# EAGLE design sensorboard_eurobotics2010_r1 (EAGLE 4.16)

## Sheet 1 of 2
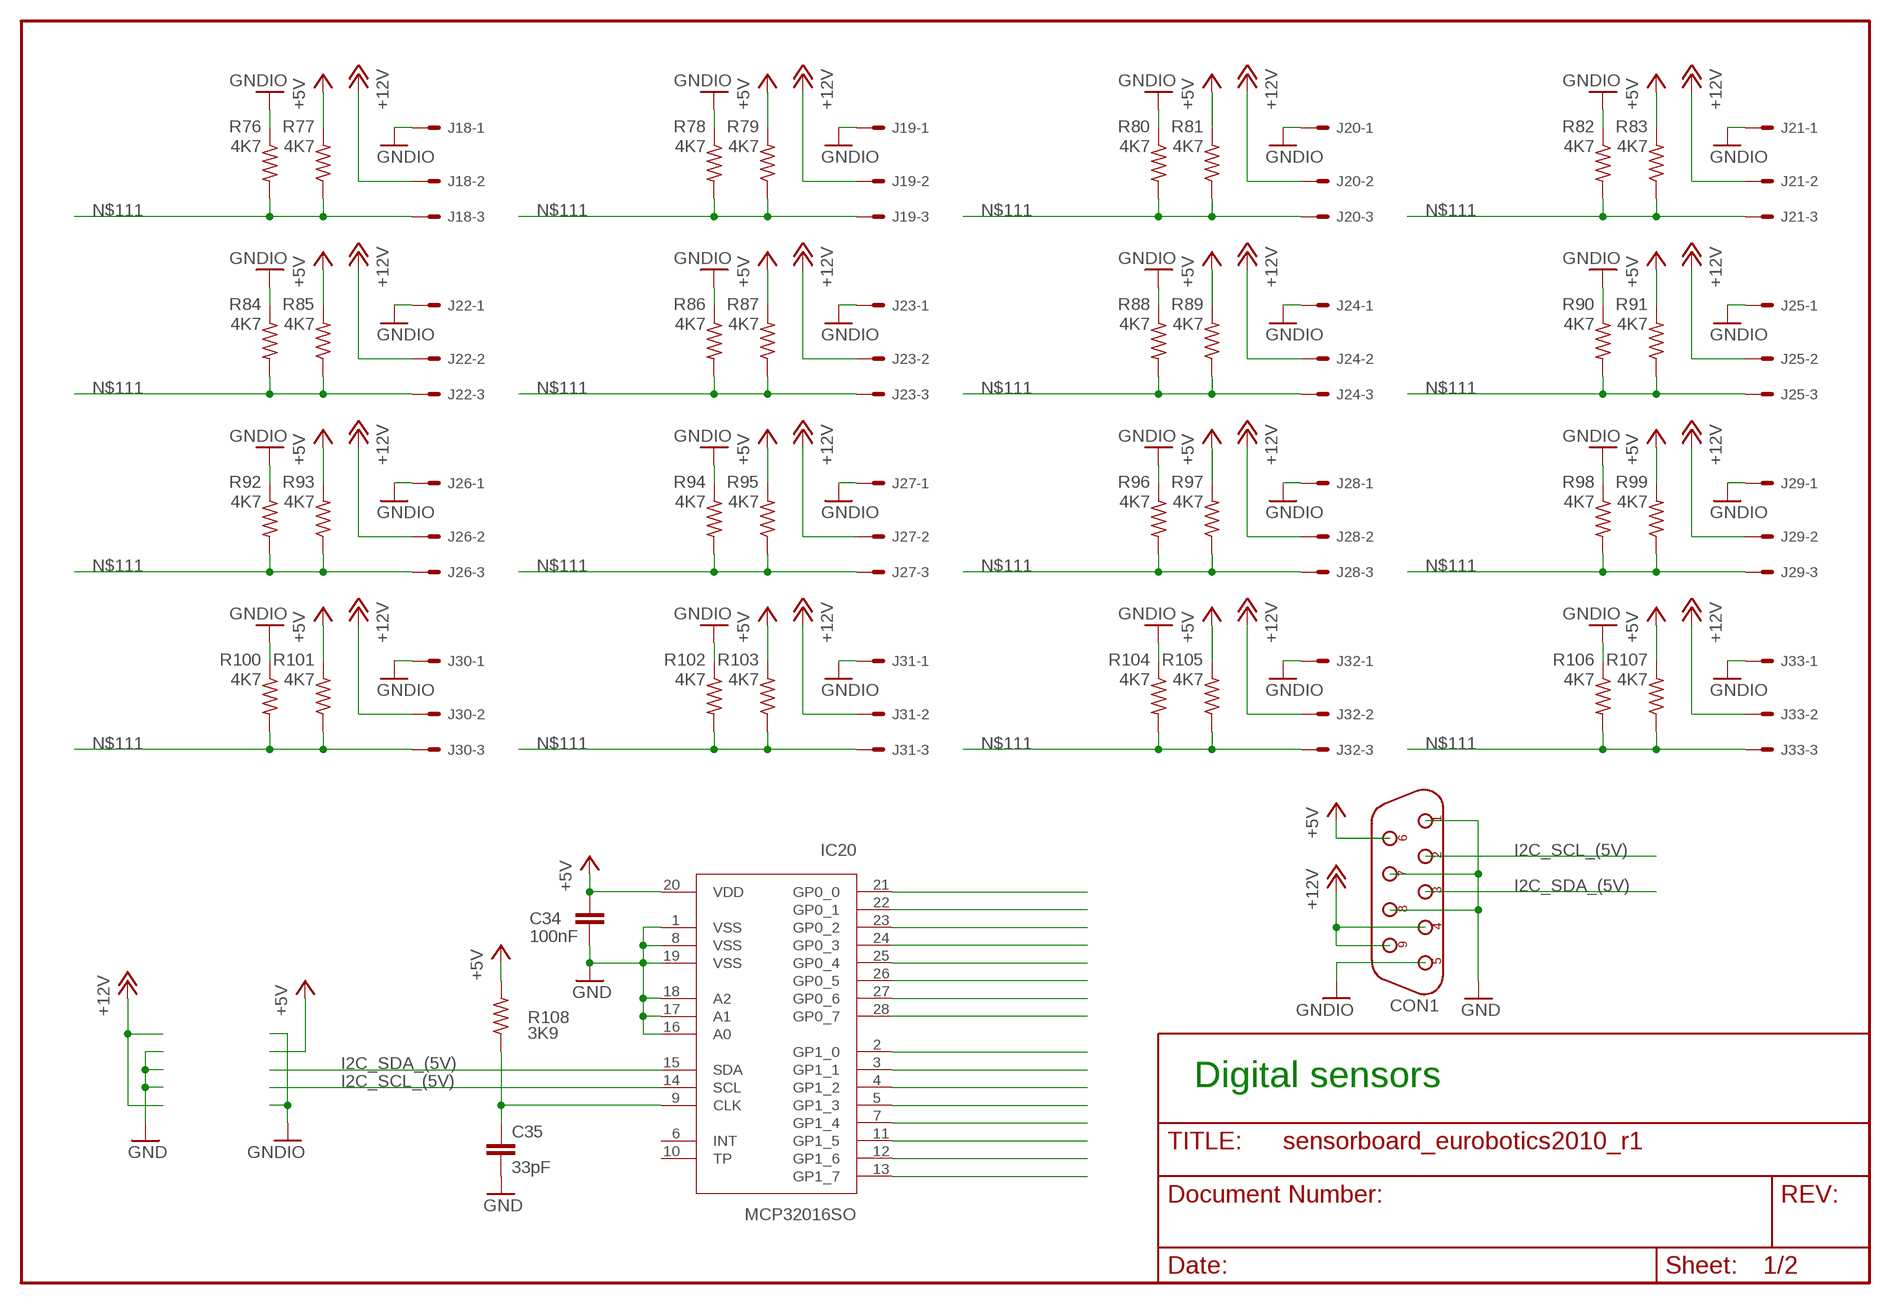
[diagram p0: schematic, sheet 1]

### Parts
C34  100nF  C-EUC0805  [C0805]
C35  33pF  C-EUC0805  [C0805]
CON1  DB9M  [D-09M]
IC20  MCP32016SO  [SO-28W]
J18  22-05-7038-03  [7395-03]
J19  22-05-7038-03  [7395-03]
J20  22-05-7038-03  [7395-03]
J21  22-05-7038-03  [7395-03]
J22  22-05-7038-03  [7395-03]
J23  22-05-7038-03  [7395-03]
J24  22-05-7038-03  [7395-03]
J25  22-05-7038-03  [7395-03]
J26  22-05-7038-03  [7395-03]
J27  22-05-7038-03  [7395-03]
J28  22-05-7038-03  [7395-03]
J29  22-05-7038-03  [7395-03]
J30  22-05-7038-03  [7395-03]
J31  22-05-7038-03  [7395-03]
J32  22-05-7038-03  [7395-03]
J33  22-05-7038-03  [7395-03]
R76  4K7  R-US_R0805  [R0805]
R77  4K7  R-US_R0805  [R0805]
R78  4K7  R-US_R0805  [R0805]
R79  4K7  R-US_R0805  [R0805]
R80  4K7  R-US_R0805  [R0805]
R81  4K7  R-US_R0805  [R0805]
R82  4K7  R-US_R0805  [R0805]
R83  4K7  R-US_R0805  [R0805]
R84  4K7  R-US_R0805  [R0805]
R85  4K7  R-US_R0805  [R0805]
R86  4K7  R-US_R0805  [R0805]
R87  4K7  R-US_R0805  [R0805]
R88  4K7  R-US_R0805  [R0805]
R89  4K7  R-US_R0805  [R0805]
R90  4K7  R-US_R0805  [R0805]
R91  4K7  R-US_R0805  [R0805]
R92  4K7  R-US_R0805  [R0805]
R93  4K7  R-US_R0805  [R0805]
R94  4K7  R-US_R0805  [R0805]
R95  4K7  R-US_R0805  [R0805]
R96  4K7  R-US_R0805  [R0805]
R97  4K7  R-US_R0805  [R0805]
R98  4K7  R-US_R0805  [R0805]
R99  4K7  R-US_R0805  [R0805]
R100  4K7  R-US_R0805  [R0805]
R101  4K7  R-US_R0805  [R0805]
R102  4K7  R-US_R0805  [R0805]
R103  4K7  R-US_R0805  [R0805]
R104  4K7  R-US_R0805  [R0805]
R105  4K7  R-US_R0805  [R0805]
R106  4K7  R-US_R0805  [R0805]
R107  4K7  R-US_R0805  [R0805]
R108  3K9  R-US_R0805  [R0805]

### Nets
+5V: C34.1 CON1.6 IC20.20(VDD) R77.2 R79.2 R81.2 R83.2 R85.2 R87.2 R89.2 R91.2 R93.2 R95.2 R97.2 R99.2 R101.2 R103.2 R105.2 R107.2 R108.2 ; also sheet 2
+12V: CON1.4 CON1.9 J18.2 J19.2 J20.2 J21.2 J22.2 J23.2 J24.2 J25.2 J26.2 J27.2 J28.2 J29.2 J30.2 J31.2 J32.2 J33.2 ; also sheet 2
GND: C34.2 C35.2 CON1.1 CON1.7 CON1.8 IC20.1(VSS) IC20.8(VSS) IC20.16(A0) IC20.17(A1) IC20.18(A2) IC20.19(VSS) ; also sheet 2
GNDIO: CON1.5 J18.1 J19.1 J20.1 J21.1 J22.1 J23.1 J24.1 J25.1 J26.1 J27.1 J28.1 J29.1 J30.1 J31.1 J32.1 J33.1 R76.1 R78.1 R80.1 R82.1 R84.1 R86.1 R88.1 R90.1 R92.1 R94.1 R96.1 R98.1 R100.1 R102.1 R104.1 R106.1 ; also sheet 2
I2C_SCL_(5V): CON1.2 IC20.14(SCL) ; also sheet 2
I2C_SDA_(5V): CON1.3 IC20.15(SDA) ; also sheet 2
N$63: C35.1 IC20.9(CLK) R108.1
N$68: IC20.21(GP0_0)
N$69: IC20.22(GP0_1)
N$97: IC20.23(GP0_2)
N$98: IC20.24(GP0_3)
N$99: IC20.25(GP0_4)
N$100: IC20.26(GP0_5)
N$101: IC20.27(GP0_6)
N$102: IC20.28(GP0_7)
N$103: IC20.2(GP1_0)
N$104: IC20.3(GP1_1)
N$105: IC20.4(GP1_2)
N$106: IC20.5(GP1_3)
N$107: IC20.7(GP1_4)
N$108: IC20.11(GP1_5)
N$109: IC20.12(GP1_6)
N$110: IC20.13(GP1_7)
N$111: J18.3 J19.3 J20.3 J21.3 J22.3 J23.3 J24.3 J25.3 J26.3 J27.3 J28.3 J29.3 J30.3 J31.3 J32.3 J33.3 R76.2 R77.1 R78.2 R79.1 R80.2 R81.1 R82.2 R83.1 R84.2 R85.1 R86.2 R87.1 R88.2 R89.1 R90.2 R91.1 R92.2 R93.1 R94.2 R95.1 R96.2 R97.1 R98.2 R99.1 R100.2 R101.1 R102.2 R103.1 R104.2 R105.1 R106.2 R107.1 ; also sheet 2
Unconnected: IC20.6(INT) IC20.10(TP)

### Notes on the sheet
- Digital sensors

## Sheet 2 of 2
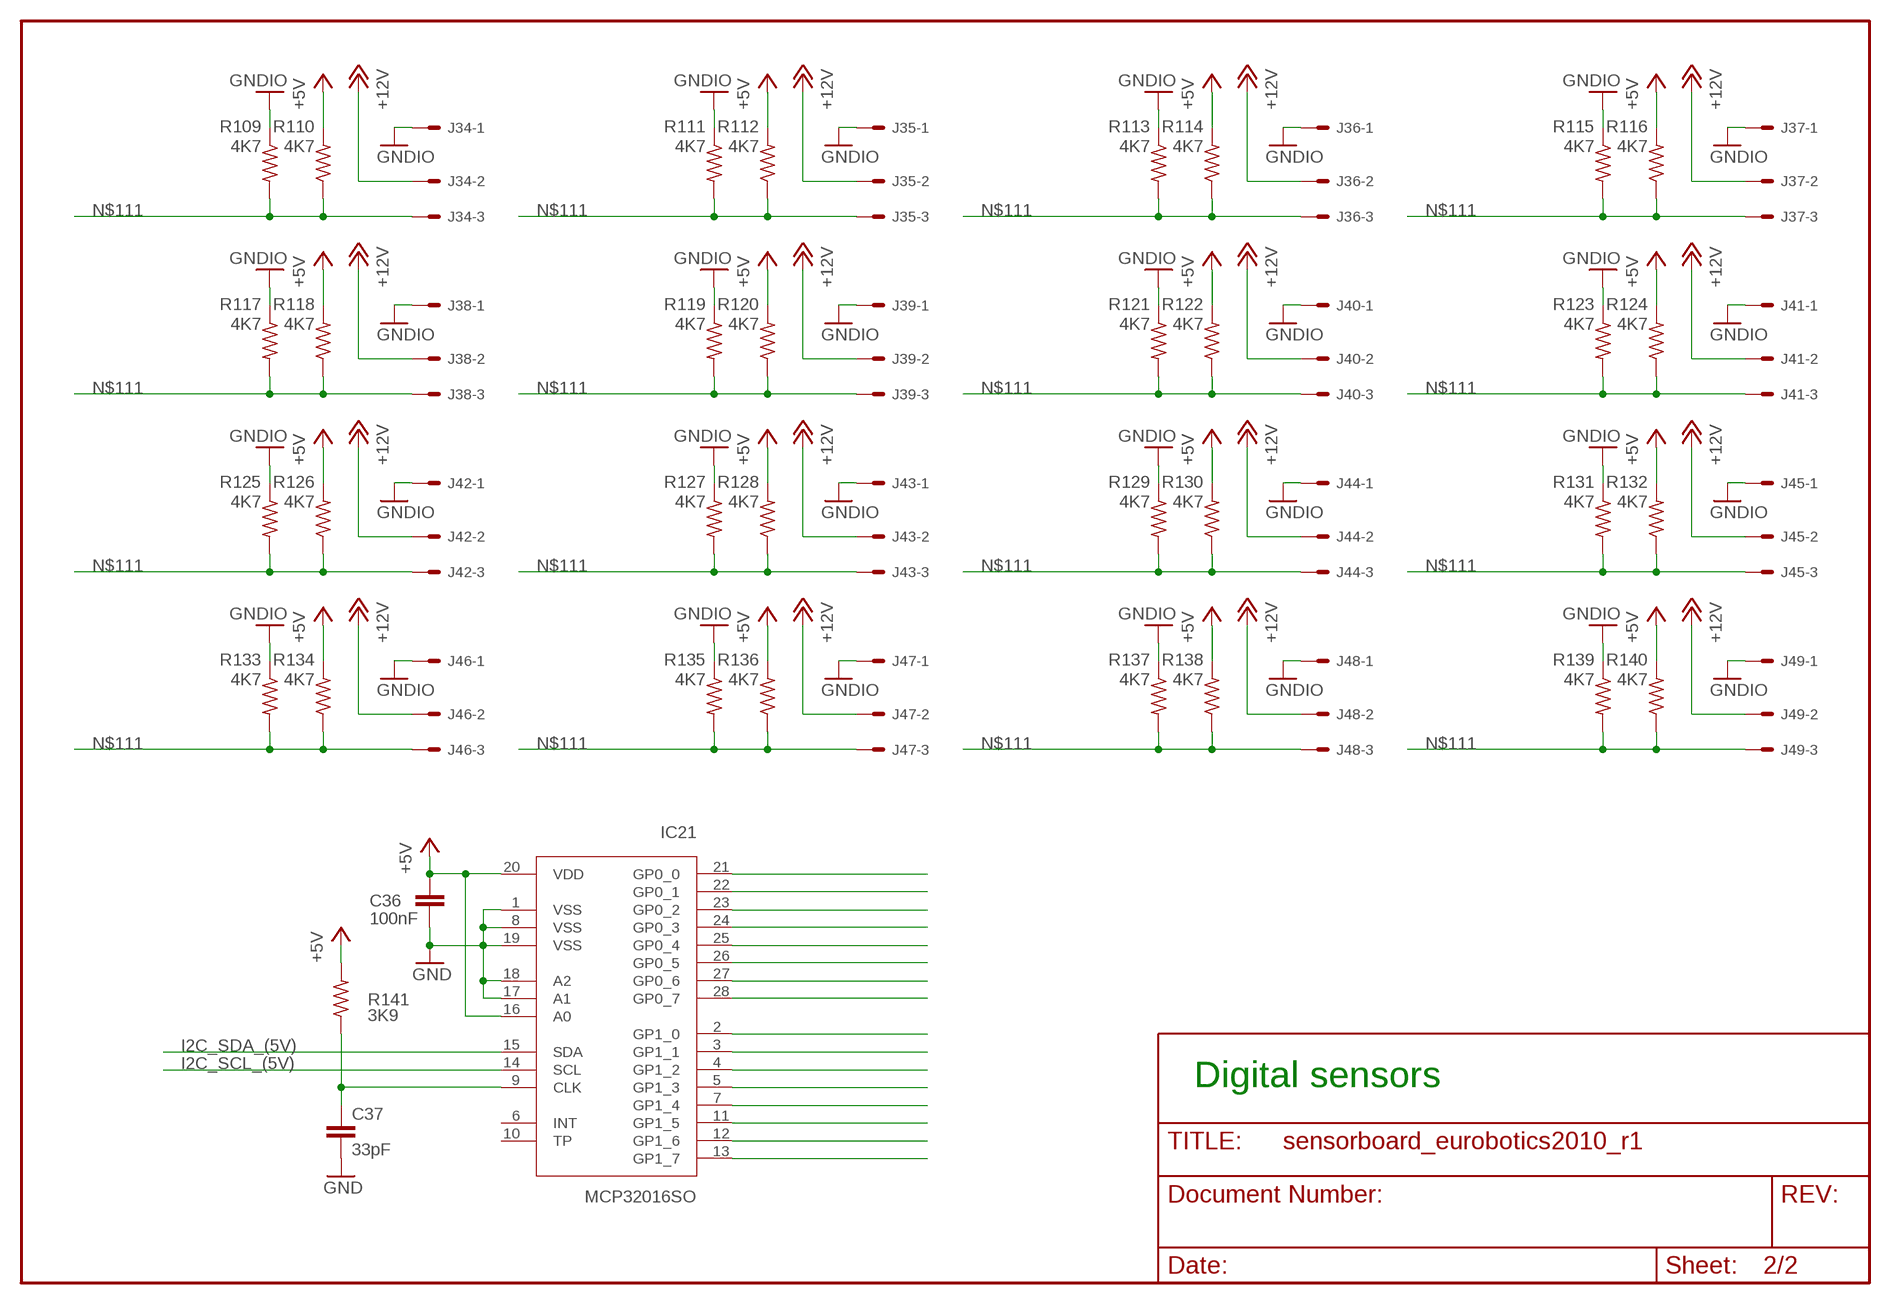
[diagram p1: schematic, sheet 2]

### Parts
C36  100nF  C-EUC0805  [C0805]
C37  33pF  C-EUC0805  [C0805]
IC21  MCP32016SO  [SO-28W]
J34  22-05-7038-03  [7395-03]
J35  22-05-7038-03  [7395-03]
J36  22-05-7038-03  [7395-03]
J37  22-05-7038-03  [7395-03]
J38  22-05-7038-03  [7395-03]
J39  22-05-7038-03  [7395-03]
J40  22-05-7038-03  [7395-03]
J41  22-05-7038-03  [7395-03]
J42  22-05-7038-03  [7395-03]
J43  22-05-7038-03  [7395-03]
J44  22-05-7038-03  [7395-03]
J45  22-05-7038-03  [7395-03]
J46  22-05-7038-03  [7395-03]
J47  22-05-7038-03  [7395-03]
J48  22-05-7038-03  [7395-03]
J49  22-05-7038-03  [7395-03]
R109  4K7  R-US_R0805  [R0805]
R110  4K7  R-US_R0805  [R0805]
R111  4K7  R-US_R0805  [R0805]
R112  4K7  R-US_R0805  [R0805]
R113  4K7  R-US_R0805  [R0805]
R114  4K7  R-US_R0805  [R0805]
R115  4K7  R-US_R0805  [R0805]
R116  4K7  R-US_R0805  [R0805]
R117  4K7  R-US_R0805  [R0805]
R118  4K7  R-US_R0805  [R0805]
R119  4K7  R-US_R0805  [R0805]
R120  4K7  R-US_R0805  [R0805]
R121  4K7  R-US_R0805  [R0805]
R122  4K7  R-US_R0805  [R0805]
R123  4K7  R-US_R0805  [R0805]
R124  4K7  R-US_R0805  [R0805]
R125  4K7  R-US_R0805  [R0805]
R126  4K7  R-US_R0805  [R0805]
R127  4K7  R-US_R0805  [R0805]
R128  4K7  R-US_R0805  [R0805]
R129  4K7  R-US_R0805  [R0805]
R130  4K7  R-US_R0805  [R0805]
R131  4K7  R-US_R0805  [R0805]
R132  4K7  R-US_R0805  [R0805]
R133  4K7  R-US_R0805  [R0805]
R134  4K7  R-US_R0805  [R0805]
R135  4K7  R-US_R0805  [R0805]
R136  4K7  R-US_R0805  [R0805]
R137  4K7  R-US_R0805  [R0805]
R138  4K7  R-US_R0805  [R0805]
R139  4K7  R-US_R0805  [R0805]
R140  4K7  R-US_R0805  [R0805]
R141  3K9  R-US_R0805  [R0805]

### Nets
+5V: C36.1 IC21.16(A0) IC21.20(VDD) R110.2 R112.2 R114.2 R116.2 R118.2 R120.2 R122.2 R124.2 R126.2 R128.2 R130.2 R132.2 R134.2 R136.2 R138.2 R140.2 R141.2 ; also sheet 1
+12V: J34.2 J35.2 J36.2 J37.2 J38.2 J39.2 J40.2 J41.2 J42.2 J43.2 J44.2 J45.2 J46.2 J47.2 J48.2 J49.2 ; also sheet 1
GND: C36.2 C37.2 IC21.1(VSS) IC21.8(VSS) IC21.17(A1) IC21.18(A2) IC21.19(VSS) ; also sheet 1
GNDIO: J34.1 J35.1 J36.1 J37.1 J38.1 J39.1 J40.1 J41.1 J42.1 J43.1 J44.1 J45.1 J46.1 J47.1 J48.1 J49.1 R109.1 R111.1 R113.1 R115.1 R117.1 R119.1 R121.1 R123.1 R125.1 R127.1 R129.1 R131.1 R133.1 R135.1 R137.1 R139.1 ; also sheet 1
I2C_SCL_(5V): IC21.14(SCL) ; also sheet 1
I2C_SDA_(5V): IC21.15(SDA) ; also sheet 1
N$2: C37.1 IC21.9(CLK) R141.1
N$4: IC21.21(GP0_0)
N$6: IC21.22(GP0_1)
N$7: IC21.23(GP0_2)
N$8: IC21.24(GP0_3)
N$9: IC21.25(GP0_4)
N$10: IC21.26(GP0_5)
N$11: IC21.27(GP0_6)
N$13: IC21.28(GP0_7)
N$14: IC21.2(GP1_0)
N$15: IC21.3(GP1_1)
N$17: IC21.4(GP1_2)
N$18: IC21.5(GP1_3)
N$19: IC21.7(GP1_4)
N$20: IC21.11(GP1_5)
N$21: IC21.12(GP1_6)
N$22: IC21.13(GP1_7)
N$111: J34.3 J35.3 J36.3 J37.3 J38.3 J39.3 J40.3 J41.3 J42.3 J43.3 J44.3 J45.3 J46.3 J47.3 J48.3 J49.3 R109.2 R110.1 R111.2 R112.1 R113.2 R114.1 R115.2 R116.1 R117.2 R118.1 R119.2 R120.1 R121.2 R122.1 R123.2 R124.1 R125.2 R126.1 R127.2 R128.1 R129.2 R130.1 R131.2 R132.1 R133.2 R134.1 R135.2 R136.1 R137.2 R138.1 R139.2 R140.1 ; also sheet 1
Unconnected: IC21.6(INT) IC21.10(TP)

### Notes on the sheet
- Digital sensors

## Library data of the parts
C34-C37 = rcl:C-EU: CAPACITOR, European symbol
CON1 = connect:DB9M
IC20 IC21 = eagle_jbs_lib:MCP32016: 16-Bit I2C I/O Expander
J18-J49 = con-molex:22-?-03: CONNECTOR wire to board 2.54 mm (.1 inch) pitch header
R76-R141 = rcl:R-US_: RESISTOR, American symbol

## Board
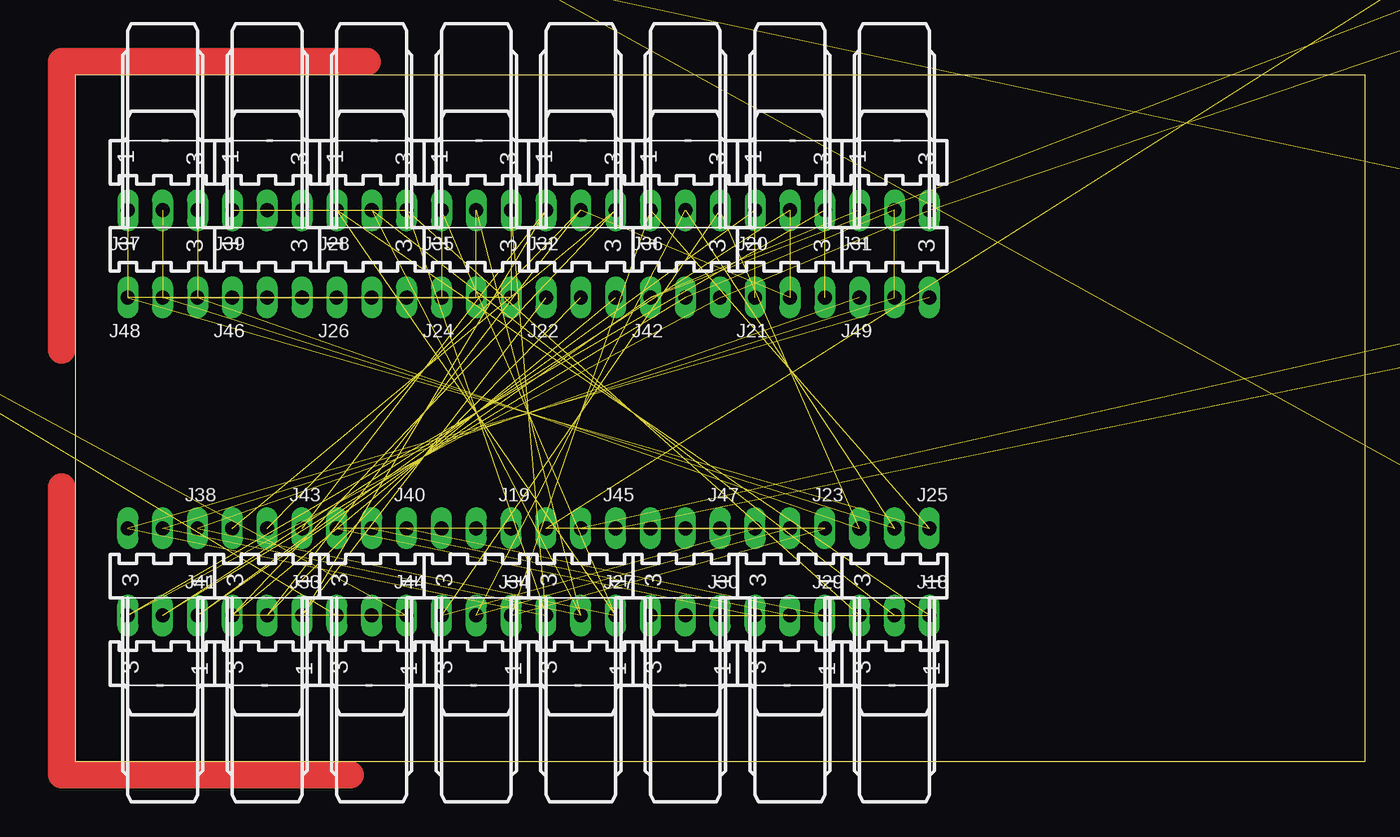
[diagram p2: board, top side]
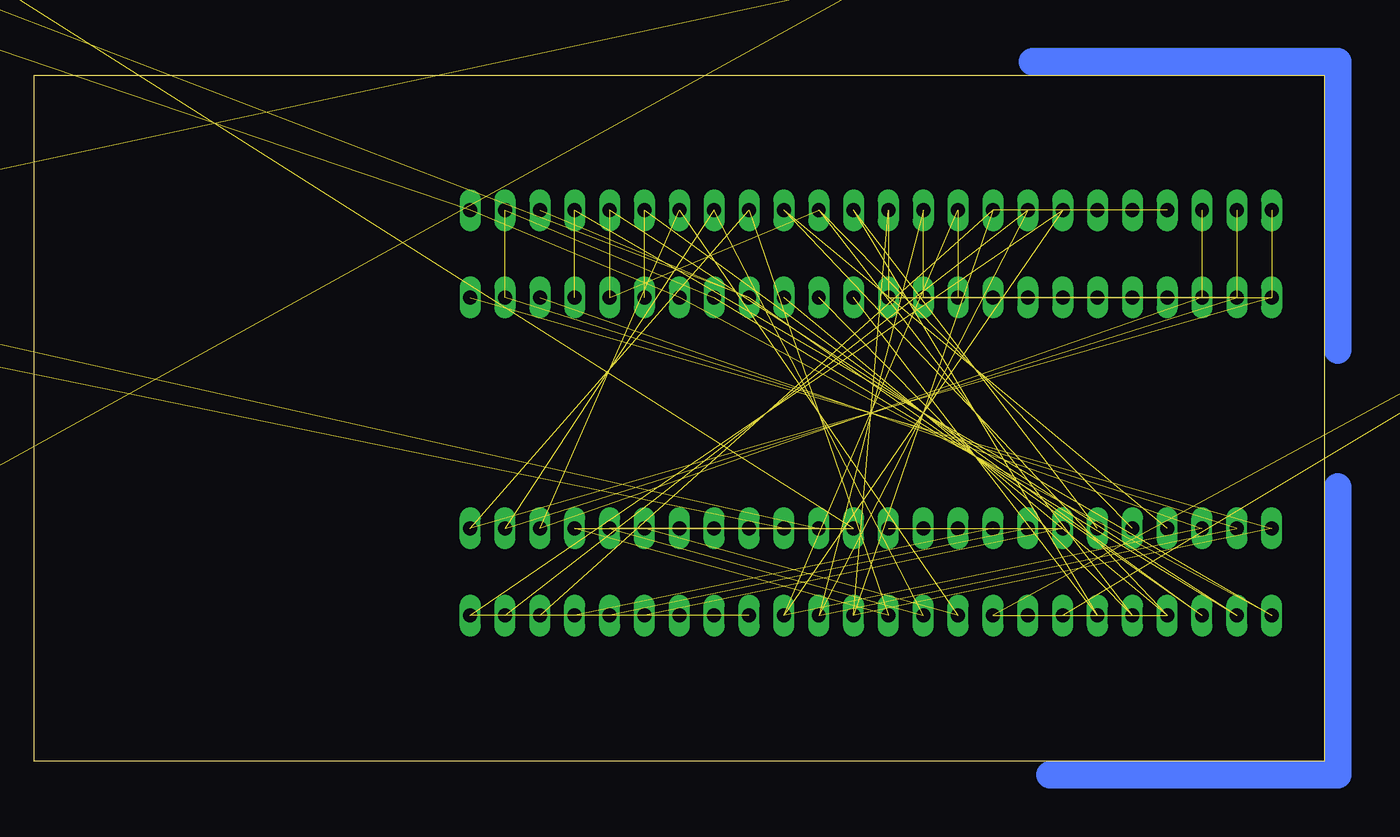
[diagram p3: board, bottom side, seen from below]

Size 94 x 50 mm. Coordinates in mm from the lower left corner, seen from the top.
Outline: 0,50 0,0 94,0 94,50 0,50
Copper layers (1*16): Top 0.035mm / dielectric 1.5mm / Bottom 0.035mm
Design rules "default": minimum track width 10mil, minimum drill 24mil, track to track 8mil, track to pad 8mil, pad to pad 8mil, via to via 8mil, smd to smd 8mil, copper to edge 40mil, drill to drill 8mil, minimum pad ring 10mil, minimum via ring 8mil, stop-mask expansion 4mil, vias tented up to drill 0mil, thermal gap 10mil

### Footprints (pad centres in the part's own frame; a part is rotated, then mirrored left to right if it is on the bottom)
C0805 = smd 1.3 x 1.5: 1 -0.85,0; 2 0.85,0
D-09M = drill 1.016 pad 1.575 octagon: 1 -5.588,1.397; 2 -2.794,1.397; 3 0,1.397; 4 2.794,1.397; 5 5.588,1.397; 6 -4.191,-1.397; 7 -1.397,-1.397; 8 1.397,-1.397; 9 4.191,-1.397 | hole 4.115: 12.192,0; -12.192,0
SO-28W = smd 0.762 x 1.27: 1 -7.62,-5.207; 2 -6.35,-5.207; 3 -5.08,-5.207; 4 -3.81,-5.207; 5 -2.54,-5.207; 6 -1.27,-5.207; 7 0,-5.207; 8 1.27,-5.207; 9 2.54,-5.207; 10 3.81,-5.207; 11 5.08,-5.207; 12 6.35,-5.207; 13 7.62,-5.207; 14 8.89,-5.207; 15 8.89,5.08; 16 7.62,5.08; 17 6.35,5.08; 18 5.08,5.08; 19 3.81,5.08; 20 2.54,5.08; 21 1.27,5.08; 22 0,5.08; 23 -1.27,5.08; 24 -2.54,5.08; 25 -3.81,5.08; 26 -5.08,5.08; 27 -6.35,5.08; 28 -7.62,5.08
7395-03 = drill 1.016 long: 1 2.54,0; 2 0,0; 3 -2.54,0
R0805 = smd 1.3 x 1.5: 1 -0.85,0; 2 0.85,0

### Placement (x,y rotation side)
C34  -18.64,101.03 0 top  (outside the outline)
C35  -30.07,101.03 0 top  (outside the outline)
C36  -41.5,101.03 0 top  (outside the outline)
C37  -52.93,101.03 0 top  (outside the outline)
CON1  110.9,37.53 270 top  (outside the outline)
IC20  140.97,37.3 270 top  (outside the outline)
IC21  130.81,8.09 270 top  (outside the outline)
J18  59.69,10.63 0 top
J19  29.21,16.98 0 top
J20  52.07,40.17 180 top
J21  52.07,33.82 180 top
J22  36.83,33.82 180 top
J23  52.07,16.98 0 top
J24  29.21,33.82 180 top
J25  59.69,16.98 0 top
J26  21.59,33.82 180 top
J27  36.83,10.63 0 top
J28  21.59,40.17 180 top
J29  52.07,10.63 0 top
J30  44.45,10.63 0 top
J31  59.69,40.17 180 top
J32  36.83,40.17 180 top
J33  13.97,10.63 0 top
J34  29.21,10.63 0 top
J35  29.21,40.17 180 top
J36  44.45,40.17 180 top
J37  6.35,40.17 180 top
J38  6.35,16.98 0 top
J39  13.97,40.17 180 top
J40  21.59,16.98 0 top
J41  6.35,10.63 0 top
J42  44.45,33.82 180 top
J43  13.97,16.98 0 top
J44  21.59,10.63 0 top
J45  36.83,16.98 0 top
J46  13.97,33.82 180 top
J47  44.45,16.98 0 top
J48  6.35,33.82 180 top
J49  59.69,33.82 180 top
R76  -47.85,50.23 0 top  (outside the outline)
R77  129.95,62.93 0 top  (outside the outline)
R78  118.52,62.93 0 top  (outside the outline)
R79  107.09,62.93 0 top  (outside the outline)
R80  95.66,62.93 0 top  (outside the outline)
R81  60.1,60.39 0 top  (outside the outline)
R82  67.72,60.39 0 top  (outside the outline)
R83  75.34,60.26 180 bottom  (outside the outline)
R84  49.94,62.93 0 top  (outside the outline)
R85  40.07,59.28 270 top  (outside the outline)
R86  28.64,64.36 270 top  (outside the outline)
R87  15.65,62.93 0 top  (outside the outline)
R88  4.22,62.93 0 top  (outside the outline)
R89  -7.21,62.93 0 top  (outside the outline)
R90  -18.64,62.93 0 top  (outside the outline)
R91  -30.07,62.93 0 top  (outside the outline)
R92  -41.5,62.93 0 top  (outside the outline)
R93  -52.93,62.93 0 top  (outside the outline)
R94  129.95,70.55 0 top  (outside the outline)
R95  118.52,70.55 0 top  (outside the outline)
R96  107.09,70.55 0 top  (outside the outline)
R97  95.66,70.55 0 top  (outside the outline)
R98  84.23,70.55 0 top  (outside the outline)
R99  72.8,70.55 0 top  (outside the outline)
R100  61.37,70.55 0 top  (outside the outline)
R101  49.94,70.55 0 top  (outside the outline)
R102  38.51,70.55 0 top  (outside the outline)
R103  27.08,70.55 0 top  (outside the outline)
R104  15.65,70.55 0 top  (outside the outline)
R105  4.22,70.55 0 top  (outside the outline)
R106  -7.21,70.55 0 top  (outside the outline)
R107  -18.64,70.55 0 top  (outside the outline)
R108  -30.07,70.55 0 top  (outside the outline)
R109  -41.5,70.55 0 top  (outside the outline)
R110  -52.93,70.55 0 top  (outside the outline)
R111  129.95,78.17 0 top  (outside the outline)
R112  118.52,78.17 0 top  (outside the outline)
R113  107.09,78.17 0 top  (outside the outline)
R114  95.66,78.17 0 top  (outside the outline)
R115  84.23,78.17 0 top  (outside the outline)
R116  72.8,78.17 0 top  (outside the outline)
R117  61.37,78.17 0 top  (outside the outline)
R118  49.94,78.17 0 top  (outside the outline)
R119  38.51,78.17 0 top  (outside the outline)
R120  27.08,78.17 0 top  (outside the outline)
R121  15.65,78.17 0 top  (outside the outline)
R122  4.22,78.17 0 top  (outside the outline)
R123  -7.21,78.17 0 top  (outside the outline)
R124  -18.64,78.17 0 top  (outside the outline)
R125  -30.07,78.17 0 top  (outside the outline)
R126  -41.5,78.17 0 top  (outside the outline)
R127  -52.93,78.17 0 top  (outside the outline)
R128  129.95,85.79 0 top  (outside the outline)
R129  118.52,85.79 0 top  (outside the outline)
R130  107.09,85.79 0 top  (outside the outline)
R131  95.66,85.79 0 top  (outside the outline)
R132  84.23,85.79 0 top  (outside the outline)
R133  72.8,85.79 0 top  (outside the outline)
R134  61.37,85.79 0 top  (outside the outline)
R135  49.94,85.79 0 top  (outside the outline)
R136  38.51,85.79 0 top  (outside the outline)
R137  27.08,85.79 0 top  (outside the outline)
R138  15.65,85.79 0 top  (outside the outline)
R139  4.22,85.79 0 top  (outside the outline)
R140  -7.21,85.79 0 top  (outside the outline)
R141  -18.64,85.79 0 top  (outside the outline)

### Tracks (layer width: path | path; a pad name or v marks a point on that pad's centre or on a via)
+5V  (39 unrouted)
+12V  (33 unrouted)
GND  (17 unrouted)
GNDIO  (64 unrouted)
I2C_SCL_(5V)  (2 unrouted)
I2C_SDA_(5V)  (2 unrouted)
N$1
  Top 2: -1,30 -1,51 21.27,51
N$2  (2 unrouted)
N$3
  Top 2: -1,20 -1,-1 20,-1
N$16
  Bottom 2: -1,30 -1,51 21.27,51
N$23
  Bottom 2: -1,20 -1,-1 20,-1
N$63  (2 unrouted)
N$111  (95 unrouted)